# Altium schematic sheet JTAG&CONFIG.SchDoc: JTAG Chain +
size 420 x 297 mm; CheckedBy: T.Janicki; CompanyName: Creotech Instruments SA; DrawnBy: Greg Kasprowicz; Organization: CERN; Address1: European Organization for Nuclear Research; Address2: CH-1211 Geneve 23 - Switzerland; DocumentNumber: 10; Revision: -; SheetNumber: 10; SheetTotal: 17; EDA_Number: EDA-xxxx; Projet: Simple VME FMC Carrier; CreateDate: 20/11/2012; CheckedDate: 23/01/2012; Title2: FPGA Flash; DivGrp: BE-CO; Designer: G.Kasprowicz; DocumentName: jtag_chain.SchDoc; ModifiedDate: -; Rule: PcbType=ProtelPcb
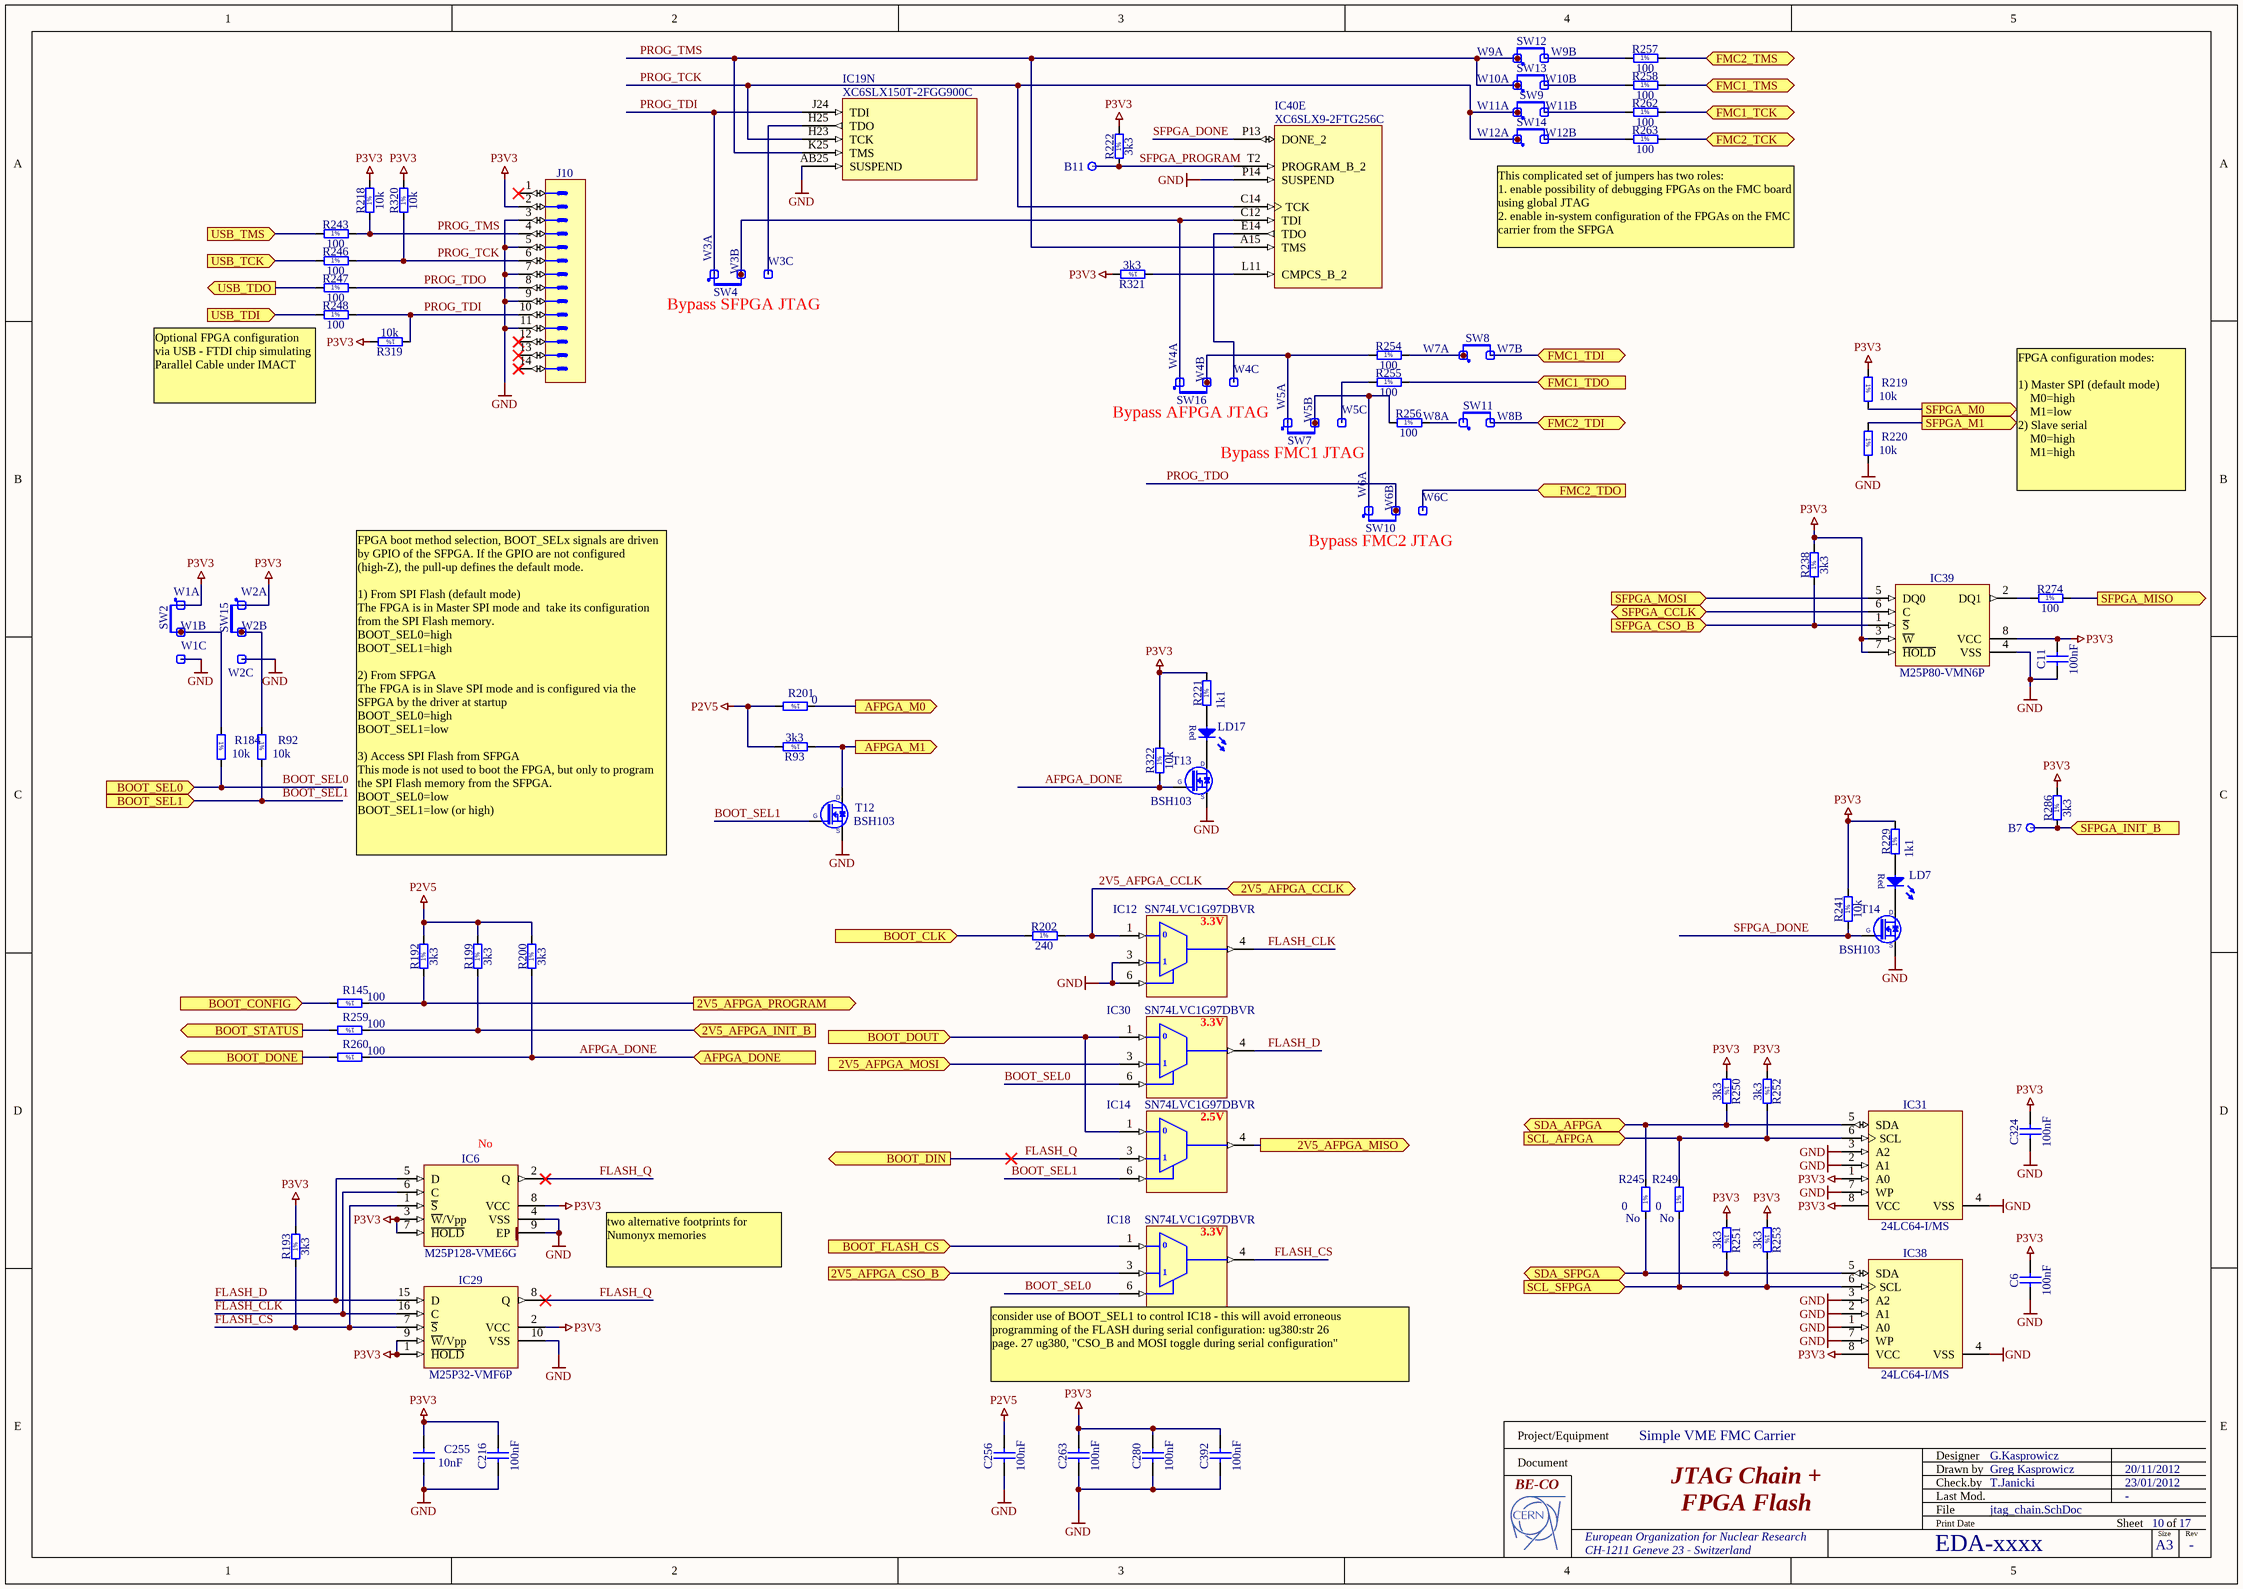
[diagram p0: JTAG&CONFIG.SchDoc]

## Parts
B7  Plated Hole  [c130h80]  (value not drawn)
B11  Plated Hole  [c130h80]  (value not drawn)
C6  100nF  [CAPC1005X55N]
C11  100nF  [CAPC1005X55N]
C216  100nF  [CAPC1005X55N]
C255  10nF  [CAPC1608X87N]
C256  100nF  [CAPC1005X55N]
C263  100nF  [CAPC1005X55N]
C280  100nF  [CAPC1005X55N]
C324  100nF  [CAPC1005X55N]
C392  100nF  [CAPC1005X55N]
IC6  M25P128-VME6G  Mounted: No  [PSON127P800X600X100-9N-R640X480]
IC12  SN74LVC1G97DBVR  [SOT95P280X145-6N]
IC14  SN74LVC1G97DBVR  [SOT95P280X145-6N]
IC18  SN74LVC1G97DBVR  [SOT95P280X145-6N]
IC19  XC6SLX150T-2FGG900C  [BGA900C100P30X30_3100X3100X260]  (part N of 18)
IC29  M25P32-VMF6P  [SOIC127P1030X265-16N]
IC30  SN74LVC1G97DBVR  [SOT95P280X145-6N]
IC31  24LC64-I/MS  [SOP65P490X110-8N]
IC38  24LC64-I/MS  [SOP65P490X110-8N]
IC39  M25P80-VMN6P  [SOIC127P600X175-8N]
IC40  XC6SLX9-2FTG256C  [BGA256C100P16X16_1700X1700X155]  (part E of 7)
J10  Milli-Grid  [MOLEX_87832-1420]  (value not drawn)
LD7  Red  [LEDC1608X80N_RED]  (value not drawn)
LD17  Red  [LEDC1608X80N_RED]  (value not drawn)
R92  10k  [RESC1608X55N]
R93  3k3  [RESC1608X55N]
R145  100  [RESC1608X55N]
R184  10k  [RESC1608X55N]
R192  3k3  [RESC1608X55N]
R193  3k3  [RESC1608X55N]
R199  3k3  [RESC1608X55N]
R200  3k3  [RESC1608X55N]
R201  0  [RESC1608X55N]
R202  240  [RESC1608X55N]
R218  10k  [RESC1608X55N]
R219  10k  [RESC1608X55N]
R220  10k  [RESC1608X55N]
R221  1k1  [RESC1608X55N]
R222  3k3  [RESC1608X55N]
R229  1k1  [RESC1608X55N]
R238  3k3  [RESC1608X55N]
R241  10k  [RESC1608X55N]
R243  100  [RESC1608X55N]
R245  0  Mounted: No  [RESC1608X55N]
R246  100  [RESC1608X55N]
R247  100  [RESC1608X55N]
R248  100  [RESC1608X55N]
R249  0  Mounted: No  [RESC1608X55N]
R250  3k3  [RESC1608X55N]
R251  3k3  [RESC1608X55N]
R252  3k3  [RESC1608X55N]
R253  3k3  [RESC1608X55N]
R254  100  [RESC1608X55N]
R255  100  [RESC1608X55N]
R256  100  [RESC1608X55N]
R257  100  [RESC1608X55N]
R258  100  [RESC1608X55N]
R259  100  [RESC1608X55N]
R260  100  [RESC1608X55N]
R262  100  [RESC1608X55N]
R263  100  [RESC1608X55N]
R274  100  [RESC1608X55N]
R286  3k3  [RESC1608X55N]
R319  10k  [RESC1608X55N]
R320  10k  [RESC1608X55N]
R321  3k3  [RESC1608X55N]
R322  10k  [RESC1608X55N]
SW2  Jumper Type1  [JUMPER_BLACK_INSULATED_2.54MM]  (value not drawn)
SW4  Jumper Type1  [JUMPER_BLACK_INSULATED_2.54MM]  (value not drawn)
SW7  Jumper Type1  [JUMPER_BLACK_INSULATED_2.54MM]  (value not drawn)
SW8  Jumper Type1  [JUMPER_BLACK_INSULATED_2.54MM]  (value not drawn)
SW9  Jumper Type1  [JUMPER_BLACK_INSULATED_2.54MM]  (value not drawn)
SW10  Jumper Type1  [JUMPER_BLACK_INSULATED_2.54MM]  (value not drawn)
SW11  Jumper Type1  [JUMPER_BLACK_INSULATED_2.54MM]  (value not drawn)
SW12  Jumper Type1  [JUMPER_BLACK_INSULATED_2.54MM]  (value not drawn)
SW13  Jumper Type1  [JUMPER_BLACK_INSULATED_2.54MM]  (value not drawn)
SW14  Jumper Type1  [JUMPER_BLACK_INSULATED_2.54MM]  (value not drawn)
SW15  Jumper Type1  [JUMPER_BLACK_INSULATED_2.54MM]  (value not drawn)
SW16  Jumper Type1  [JUMPER_BLACK_INSULATED_2.54MM]  (value not drawn)
T12  BSH103  [SOT95P230X110-3N]
T13  BSH103  [SOT95P230X110-3N]
T14  BSH103  [SOT95P230X110-3N]
W1  Test Point  [COMATEL_385.0358.1.03.400]  (value not drawn)  (parts A,B,C of 3)
W2  Test Point  [COMATEL_385.0358.1.03.400]  (value not drawn)  (parts A,B,C of 3)
W3  Test Point  [COMATEL_385.0358.1.03.400]  (value not drawn)  (parts A,B,C of 3)
W4  Test Point  [COMATEL_385.0358.1.03.400]  (value not drawn)  (parts A,B,C of 3)
W5  Test Point  [COMATEL_385.0358.1.03.400]  (value not drawn)  (parts A,B,C of 3)
W6  Test Point  [COMATEL_385.0358.1.03.400]  (value not drawn)  (parts A,B,C of 3)
W7  Test Point  [COMATEL_385.0358.1.02.400]  (value not drawn)  (parts A,B of 2)
W8  Test Point  [COMATEL_385.0358.1.02.400]  (value not drawn)  (parts A,B of 2)
W9  Test Point  [COMATEL_385.0358.1.02.400]  (value not drawn)  (parts A,B of 2)
W10  Test Point  [COMATEL_385.0358.1.02.400]  (value not drawn)  (parts A,B of 2)
W11  Test Point  [COMATEL_385.0358.1.02.400]  (value not drawn)  (parts A,B of 2)
W12  Test Point  [COMATEL_385.0358.1.02.400]  (value not drawn)  (parts A,B of 2)

## Ports
2V5_AFPGA_CCLK (bidir), 2V5_AFPGA_CSO_B (in), 2V5_AFPGA_INIT_B (in), 2V5_AFPGA_MISO (out), 2V5_AFPGA_MOSI (in), 2V5_AFPGA_PROGRAM (out), AFPGA_DONE (in), AFPGA_M0 (out), AFPGA_M1 (out), BOOT_CLK (in), BOOT_CONFIG (in), BOOT_DIN (out), BOOT_DONE (out), BOOT_DOUT (in), BOOT_FLASH_CS (in), BOOT_SEL0 (in), BOOT_SEL1 (in), BOOT_STATUS (out), FMC1_TCK (bidir), FMC1_TDI (bidir), FMC1_TDO (in), FMC1_TMS (bidir), FMC2_TCK (bidir), FMC2_TDI (bidir), FMC2_TDO (in), FMC2_TMS (bidir), SCL_AFPGA (in), SCL_SFPGA (in), SDA_AFPGA (bidir), SDA_SFPGA (bidir), SFPGA_CCLK (bidir), SFPGA_CSO_B (in), SFPGA_INIT_B (in), SFPGA_M0 (out), SFPGA_M1 (out), SFPGA_MISO (out), SFPGA_MOSI (in), USB_TCK (in), USB_TDI (in), USB_TDO (out), USB_TMS (in)

## Nets
GND: C6.2 C11.2 C216.1 C255.1 C256.1 C263.1 C280.1 C324.2 C392.1 IC6.4(VSS) IC6.9(EP) IC12.2(GND) IC12.3(IN0) IC12.6(IN2) IC14.2(GND) IC18.2(GND) IC19.AB25(SUSPEND) IC29.10(VSS) IC30.2(GND) IC31.2(A1) IC31.3(A2) IC31.4(VSS) IC31.7(WP) IC38.1(A0) IC38.2(A1) IC38.3(A2) IC38.4(VSS) IC38.7(WP) IC39.4(VSS) IC40.P14(SUSPEND) J10.3 J10.5 J10.7 J10.9 J10.11 R220.2 T12.2(S) T13.2(S) T14.2(S) W1.3 W2.3
P2V5: C256.2 IC14.5(VCC) R93.2 R192.2 R199.2 R200.2 R201.2
P3V3: C6.1 C11.1 C216.2 C255.2 C263.2 C280.2 C324.1 C392.2 IC6.3(~{W}/Vpp) IC6.7(~{HOLD}) IC6.8(VCC) IC12.5(VCC) IC18.5(VCC) IC29.1(~{HOLD}) IC29.2(VCC) IC29.9(~{W}/Vpp) IC30.5(VCC) IC31.1(A0) IC31.8(VCC) IC38.8(VCC) IC39.3(~{W}) IC39.7(~{HOLD}) IC39.8(VCC) J10.2 R193.2 R218.2 R219.1 R221.2 R222.2 R229.2 R238.2 R241.2 R250.1 R251.1 R252.1 R253.1 R286.2 R319.2 R320.2 R321.2 R322.2 W1.1 W2.1
2V5_AFPGA_CCLK: IC12.1(IN1) R202.2 ; port 2V5_AFPGA_CCLK
2V5_AFPGA_CSO_B: IC18.3(IN0) ; port 2V5_AFPGA_CSO_B
2V5_AFPGA_INIT_B: R199.1 R259.1 ; port 2V5_AFPGA_INIT_B
2V5_AFPGA_MISO: IC14.4(Y) ; port 2V5_AFPGA_MISO
2V5_AFPGA_MOSI: IC30.3(IN0) ; port 2V5_AFPGA_MOSI
2V5_AFPGA_PROGRAM: R145.1 R192.1 ; port 2V5_AFPGA_PROGRAM
AFPGA_DONE: R200.1 R260.1 R322.1 T13.1(G) ; port AFPGA_DONE
AFPGA_M0: R201.1 ; port AFPGA_M0
AFPGA_M1: R93.1 T12.3(D) ; port AFPGA_M1
BOOT_CLK: R202.1 ; port BOOT_CLK
BOOT_CONFIG: R145.2 ; port BOOT_CONFIG
BOOT_DONE: R260.2 ; port BOOT_DONE
BOOT_DOUT: IC14.1(IN1) IC30.1(IN1) ; port BOOT_DOUT
BOOT_FLASH_CS: IC18.1(IN1) ; port BOOT_FLASH_CS
BOOT_SEL0: IC18.6(IN2) IC30.6(IN2) R184.2 ; port BOOT_SEL0
BOOT_SEL1: IC14.6(IN2) R92.2 T12.1(G) ; port BOOT_SEL1
BOOT_STATUS: R259.2 ; port BOOT_STATUS
FLASH_CLK: IC6.6(C) IC12.4(Y) IC29.16(C)
FLASH_CS: IC6.1(~{S}) IC18.4(Y) IC29.7(~{S}) R193.1
FLASH_D: IC6.5(D) IC29.15(D) IC30.4(Y)
FLASH_Q: IC6.2(Q) IC14.3(IN0) IC29.8(Q) ; port BOOT_DIN
FMC1_TCK: R262.2 ; port FMC1_TCK
FMC1_TDI: W7.2 ; port FMC1_TDI
FMC1_TDO: R255.2 ; port FMC1_TDO
FMC1_TMS: R258.2 ; port FMC1_TMS
FMC2_TCK: R263.2 ; port FMC2_TCK
FMC2_TDI: W8.2 ; port FMC2_TDI
FMC2_TDO: W6.3 ; port FMC2_TDO
FMC2_TMS: R257.2 ; port FMC2_TMS
PROG_TCK: IC19.H23(TCK) IC40.C14(TCK) J10.6 R246.2 R320.1 SW9.1 SW14.1 W11.1 W12.1
PROG_TDI: IC19.J24(TDI) J10.10 R248.2 R319.1 W3.1
PROG_TDO: J10.8 R247.2 SW10.1 W6.2
PROG_TMS: IC19.K25(TMS) IC40.A15(TMS) J10.4 R218.1 R243.2 SW12.1 SW13.1 W9.1 W10.1
SCL_AFPGA: IC31.6(SCL) R249.2 R252.2 ; port SCL_AFPGA
SCL_SFPGA: IC38.6(SCL) R249.1 R253.2 ; port SCL_SFPGA
SDA_AFPGA: IC31.5(SDA) R245.2 R250.2 ; port SDA_AFPGA
SDA_SFPGA: IC38.5(SDA) R245.1 R251.2 ; port SDA_SFPGA
SFPGA_CCLK: IC39.6(C) ; port SFPGA_CCLK
SFPGA_CSO_B: IC39.1(~{S}) R238.1 ; port SFPGA_CSO_B
SFPGA_DONE: IC40.P13(DONE_2) R241.1 T14.1(G)
SFPGA_INIT_B: B7.1 R286.1 ; port SFPGA_INIT_B
SFPGA_M0: R219.2 ; port SFPGA_M0
SFPGA_M1: R220.1 ; port SFPGA_M1
SFPGA_MISO: R274.2 ; port SFPGA_MISO
SFPGA_MOSI: IC39.5(DQ0) ; port SFPGA_MOSI
SFPGA_PROGRAM: B11.1 IC40.T2(PROGRAM_B_2) R222.1
USB_TCK: R246.1 ; port USB_TCK
USB_TDI: R248.1 ; port USB_TDI
USB_TDO: R247.1 ; port USB_TDO
USB_TMS: R243.1 ; port USB_TMS
NetIC19_H25: IC19.H25(TDO) W3.3
NetIC39_2: IC39.2(DQ1) R274.1
NetIC40_C12: IC40.C12(TDI) SW4.1 W3.2 W4.1
NetIC40_E14: IC40.E14(TDO) W4.3
NetIC40_L11: IC40.L11(CMPCS_B_2) R321.1
NetLD7_1: LD7.1(C) T14.3(D)
NetLD7_2: LD7.2(A) R229.1
NetLD17_1: LD17.1(C) T13.3(D)
NetLD17_2: LD17.2(A) R221.1
NetR92_1: R92.1 SW15.1 W2.2
NetR184_1: R184.1 SW2.1 W1.2
NetR254_1: R254.1 SW16.1 W4.2 W5.1
NetR254_2: R254.2 SW8.1 W7.1
NetR255_1: R255.1 W5.3
NetR256_1: R256.1 SW7.1 W5.2 W6.1
NetR257_1: R257.1 W9.2
NetR258_1: R258.1 W10.2
NetR262_1: R262.1 W11.2
NetR263_1: R263.1 W12.2
NetSW11_1: SW11.1 W8.1

Not connected (* = marked no-connect by the designer): J10 1* 12* 13* 14*; R256 2

## Notes on the sheet
- This complicated set of jumpers has two roles:
  1. enable possibility of debugging FPGAs on the FMC board using global JTAG
  2. enable in-system configuration of the FPGAs on the FMC carrier from the SFPGA
- Bypass SFPGA JTAG
- (near R248) Optional FPGA configuration via USB - FTDI chip simulating Parallel Cable under IMACT
- Bypass AFPGA JTAG
- Bypass FMC1 JTAG
- FPGA configuration modes:
  1) Master SPI (default mode)
  M0=high
  M1=low
  2) Slave serial
  M0=high
  M1=high
- Bypass FMC2 JTAG
- FPGA boot method selection, BOOT_SELx signals are driven by GPIO of the SFPGA. If the GPIO are not configured (high-Z), the pull-up defines the default mode.
  1) From SPI Flash (default mode)
  The FPGA is in Master SPI mode and  take its configuration from the SPI Flash memory.
  BOOT_SEL0=high
  BOOT_SEL1=high
  2) From SFPGA
  The FPGA is in Slave SPI mode and is configured via the SFPGA by the driver at startup
  BOOT_SEL0=high
  BOOT_SEL1=low
  3) Access SPI Flash from SFPGA
  This mode is not used to boot the FPGA, but only to program the SPI Flash memory from the SFPGA.
  BOOT_SEL0=low
  BOOT_SEL1=low (or high)
- (near IC12) 0
- (near IC12) 3.3V
- (near IC12) 1
- (near IC30) 3.3V
- (near IC30) 0
- (near IC30) 1
- (near IC14) 0
- (near IC14) 2.5V
- (near IC14) 1
- two alternative footprints for Numonyx memories
- (near IC18) 0
- (near IC18) 1
- (near IC18) 3.3V
- (near IC18) consider use of BOOT_SEL1 to control IC18 - this will avoid erroneous programming of the FLASH during serial configuration: ug380:str 26
  page. 27 ug380, "CSO_B and MOSI toggle during serial configuration"
- Project/Equipment
- Document
- Designer
- Drawn by
- Check.by
- File
- Last Mod.
- Print Date
- Sheet
- Size
- A3
- of
- Rev
- (in symbol R0603_0R_JUMPER) 1%
- (in symbol R0603_1K1_1%_0.1W_100PPM) 1%
- (in symbol R0603_3K3_1%_0.1W_100PPM) 1%
- (in symbol R0603_10K_1%_0.1W_100PPM) 1%
- (in symbol R0603_100R_1%_0.1W_100PPM) 1%
- (in symbol R0603_240R_1%_0.1W_100PPM) 1%

## Library data of the parts
B7 B11 = PLATED_HOLE0.8_PAD1.3: Single Terminal Socket; Part Description: Plated Through Hole: Hole Dia.=0.8mm Pad Dia.=1.3mm; Mounted: No; Table: Pads; Part Number: PLATED_HOLE0.8_PAD1.3; Component Kind: Standard (No BOM); Component Type: Standard (No BOM); Pin Count: 1; Family: Plated Hole; Socket: No; SMD: No; Status: None; ComponentHeight: 0mm; Author: CERN DEM JLC; CreateDate: 2008-10-30; LatestRevisionDate: 2008-10-30; PackageDescription: Plated Through Hole: Hole Dia.=0.8mm Pad Dia.=1.3mm
C6 C11 C216 C256 C263 C280 C324 C392 = CC0402_100NF_16V_10%_X7R: Non-polarised capacitor; Part Description: SMD Multilayer Chip Ceramic Capacitor; Manufacturer: GENERIC; Manufacturer1 Part Number: 223878715649; Voltage: 16V; TC: X7R; Tolerance: ±10%; Table: Capacitors SMD; Part Number: CC0402_100NF_16V_10%_X7R; Component Kind: Standard; Component Type: Standard; Pin Count: 2; Value: 100nF; Status: Not Recommended; Manufacturer Part Number: CC0402_100NF_16V_10%_X7R; Case: 0402; Mounted: Yes; Socket: No; SMD: Yes; Manufacturer1 Example: PHYCOMP; Manufacturer1 ComponentHeight: 0.55mm; HelpURL: \\cern.ch\dfs\Applications\Altium\Datasheets\CC0402_X7R_PHYCOMP.pdf; Author: CERN DEM JLC
  C6 C11 C324: CreateDate: 12/3/2007; LatestRevisionDate: 12/3/2007
  C216 C256 C263 C280 C392: CreateDate: 2007-12-03; LatestRevisionDate: 2007-12-03
C255 = CC0603_10NF_50V_10%_X7R: Non-polarised capacitor; Part Description: SMD Multilayer Chip Ceramic Capacitor; Manufacturer: GENERIC; Manufacturer1 Part Number: 223858615636; Voltage: 50V; TC: X7R; Tolerance: ±10%; Table: Capacitors SMD; Part Number: CC0603_10NF_50V_10%_X7R; Component Kind: Standard; Component Type: Standard; Pin Count: 2; Value: 10nF; Status: Preferred; Manufacturer Part Number: CC0603_10NF_50V_10%_X7R; Case: 0603; Mounted: Yes; Socket: No; SMD: Yes; Manufacturer1 Example: PHYCOMP; Manufacturer1 ComponentHeight: 0.87mm; HelpURL: \\cern.ch\dfs\Applications\Altium\Datasheets\CC0603_X7R_PHYCOMP.pdf; Author: CERN DEM JLC; CreateDate: 03/12/2007; LatestRevisionDate: 03/12/2007
IC6 = M25P128-VME6G: 128 Mbit (Multilevel), low-voltage, Serial Flash memory with 50-MHz SPI bus interface; Manufacturer: NUMONYX; Table: Logic; Part Number: M25P128-VME6G; Component Kind: Standard; Component Type: Standard; Device: M25P128-VME6G; PackageDescription: SON,1.27mm,pitch; 8 pin,8.00mm W X 6.00mm L X 1.00mm H body (w/pullback leads,thermal tab 6.4 X 4.8mm), IPC Medium Density; Part Description: 128 Mbit (Multilevel), Low-Voltage, Serial Flash Memory With 50-MHz SPI Bus Interface; Manufacturer Part Number: M25P128-VME6G; Pin Count: 9; Case: SON8; Socket: No; SMD: Yes; ComponentHeight: 1mm; HelpURL: \\cern.ch\dfs\Applications\Altium\Datasheets\M25P128-VME6G.pdf; Author: CERN DEM JLC; CreateDate: 2010-01-20; LatestRevisionDate: 2010-01-20
IC12 IC14 IC18 IC30 = SN74LVC1G97DBVR: Configurable Multiple-Function Gate; Manufacturer: TEXAS INSTRUMENTS; Table: Standard Logic; Part Number: SN74LVC1G97DBVR; Component Kind: Standard; Component Type: Standard; Device: SN74LVC1G97DBVR; PackageDescription: SOT23, 6-Leads, Body 3.0x3.0mm (max), Pitch 0.95mm, IPC Medium Density; Part Description: Configurable Multiple-Function Gate; Manufacturer Part Number: SN74LVC1G97DBVR; Pin Count: 6; Case: SOT23-6; Mounted: Yes; Socket: No; SMD: Yes; ComponentHeight: 1.45mm; Author: CERN DEM JLC; HelpURL: \\cern.ch\dfs\Applications\Altium\Datasheets\SN74LVC1G97DBVR.pdf; CreateDate: 2/15/2011; LatestRevisionDate: 2/15/2011
IC19 = XC6SLX150T-2FGG900C: SPARTAN-6, FPGA, 900-Ball BGA, Commercial Grade, Pb-Free; Part Description: SPARTAN-6, FPGA, 540 User I/Os, 8 GTPs, 900-Ball BGA, Commercial Grade, Pb-Free; Manufacturer: XILINX; Table: Logic; Part Number: XC6SLX150T-2FGG900C; Component Kind: Standard; Component Type: Standard; Device: XC6SLX150T-2FGG900C; PackageDescription: BGA,1.00mm pitch, square; 900 pin, 30 columns X 30 rows, 31.00mm X 31.00mm X 2.60mm H, IPC Medium Density; Manufacturer Part Number: XC6SLX150T-2FGG900C; Pin Count: 900; Case: BGA900; Mounted: Yes; Socket: No; SMD: Yes; ComponentHeight: 2.6mm; HelpURL: \\cern.ch\dfs\Applications\Altium\Datasheets\XC6SLX150T-2FGG900C.pdf; ComponentLink1URL: \\cern.ch\dfs\Applications\Altium\Datasheets\XC6SLX150T-2FGG900C_Package-Pinouts.pdf; ComponentLink1Description: Package/Pinouts; Author: CERN DEM JLC; CreateDate: 2009-11-17; LatestRevisionDate: 2009-11-17
IC29 = M25P32-VMF6P: 32 Mbit, low-voltage, Serial Flash memory with 75-MHz SPI bus interface; Part Description: 32 Mbit, Low-Voltage, Serial Flash Memory With 75MHz SPI Bus Interface; Manufacturer: MICRON; Table: Logic; Part Number: M25P32-VMF6P; Component Kind: Standard; Component Type: Standard; Device: M25P32-VMF6P; PackageDescription: SOIC 16, Pitch 1.27mm - Body 7.5x10.3mm, IPC Medium Density; Manufacturer Part Number: M25P32-VMF6P; Pin Count: 8; Case: SOIC16; Mounted: Yes; Socket: No; SMD: Yes; ComponentHeight: 2.65mm; HelpURL: \\cern.ch\dfs\Applications\Altium\Datasheets\M25P32-VMF6P.pdf; Author: CERN DEM JLC; CreateDate: 2010-10-21; LatestRevisionDate: 2011-07-18
IC31 IC38 = 24LC64-I/MS: 64K I2C Serial EEPROM; Part Description: 2.5V-5.5V, 64K (8K x 8-bit) I2C Serial EEPROM; Manufacturer: MICROCHIP TECHNOLOGY; Table: Logic; Part Number: 24LC64-I/MS; Component Kind: Standard; Component Type: Standard; Device: 24LC64-I/MS; PackageDescription: SOP, 0.65mm pitch; 8 pin, 3.00mm W X 3.00mm L X 1.10mm H body, IPC Medium Density; Manufacturer Part Number: 24LC64-I/MS; Pin Count: 8; Case: MSOP8; Mounted: Yes; Socket: No; SMD: Yes; ComponentHeight: 1.1mm; HelpURL: \\cern.ch\dfs\Applications\Altium\Datasheets\24LC64-I-MS.pdf; Author: CERN DEM JLC; CreateDate: 2011-01-24; LatestRevisionDate: 2011-01-24
IC39 = M25P80-VMN6P: 8 Mbit, 2.7V to 3.6V Serial Flash Embedded Memory; Manufacturer: NUMONYX; Table: Logic; Part Number: M25P80-VMN6P; Component Kind: Standard; Component Type: Standard; Device: M25P80-VMN6P; PackageDescription: SOIC 8, Pitch 1.27mm - Body 4x5mm, IPC Medium Density; Part Description: 8 Mbit, 2.7V to 3.6V Serial Flash Embedded Memory; Manufacturer Part Number: M25P80-VMN6P; Pin Count: 8; Case: SOIC8; Mounted: Yes; Socket: No; SMD: Yes; ComponentHeight: 1.75mm; HelpURL: \\cern.ch\dfs\Applications\Altium\Datasheets\M25P80-VMN6P.pdf; Author: CERN DEM JLC; CreateDate: 2011-10-05; LatestRevisionDate: 2011-10-05
IC40 = XC6SLX9-2FTG256C: Spartan-6 LX 1.2V FPGA, 186 User I/Os, 256-Ball Fine-Pitch Thin BGA (1.0mm Pitch), Speed Grade 2, Commercial Grade, Pb-Free; Manufacturer: XILINX; Table: Logic; Part Number: XC6SLX9-2FTG256C; Component Kind: Standard; Component Type: Standard; Device: XC6SLX9-2FTG256C; PackageDescription: BGA 1mm, Pitch, Square 256 Pin, 16 Columns x 16 Rows, Body 17mm X 17mm X 1.55mm H; Part Description: Spartan-6 LX 1.2V FPGA, 186 User I/Os, 256-Ball Fine-Pitch Thin BGA (1.0mm Pitch), Speed Grade 2, Commercial Grade, Pb-Free; Manufacturer Part Number: XC6SLX9-2FTG256C; Pin Count: 256; Case: BGA256; Mounted: Yes; Socket: No; SMD: Yes; ComponentHeight: 1.55mm; HelpURL: \\cern.ch\dfs\Applications\Altium\Datasheets\XC6SLX9-2FTG256C.pdf; ComponentLink1URL: \\cern.ch\dfs\Applications\Altium\Datasheets\XC6SLX9-2FTG256C_Package-Pinout.pdf; ComponentLink1Description: Package/Pinouts; Author: CERN DEM JLC; CreateDate: 2011-11-01; LatestRevisionDate: 2011-11-01
J10 = MOLEX_87832-1420: Connector 14 Male; Part Description: 2.00mm (.079") Pitch Milli-Grid™ Header, Surface Mount, Vertical, Shrouded, 14 Circuits,with Locking Windows and Centre Polarization Slot, PCB Locator; Manufacturer: MOLEX; Part Number: MOLEX_87832-1420; Component Kind: Standard; Component Type: Standard; Pin Count: 14; Family: Milli-Grid; Mounted: Yes; Socket: No; SMD: Yes; Manufacturer Part Number: 87832-1420; ComponentHeight: 6.4mm; HelpURL: \\cern.ch\dfs\Applications\Altium\Datasheets\MOLEX_87832-1420.pdf; Author: CERN DEM JLC; CreateDate: 9/9/2008; LatestRevisionDate: 9/9/2008; Table: MOLEX
LD7 LD17 = LED_ROHM_SML-311UTT86K: LED Red 1C 2A; Part Description: Low current chip LED SML-311 Serie; Manufacturer: ROHM; Table: LEDs & Displays; Part Number: LED_ROHM_SML-311UTT86K; Component Kind: Standard; Component Type: Standard; Color: Red; PackageDescription: Chip RED LED, 2-Leads, Body 1.6x0.8mm, IPC Medium Density; Manufacturer Part Number: SML-311UTT86K; Pin Count: 2; Mounted: Yes; Socket: No; SMD: Yes; ComponentHeight: 0.8mm; HelpURL: \\cern.ch\dfs\Applications\Altium\Datasheets\LED_ROHM_SML-311UTT86K.pdf; Author: CERN DEM JLC; CreateDate: 3/16/2010; LatestRevisionDate: 3/17/2010
R92 R184 R218-R220 R241 R319 R320 R322 = R0603_10K_1%_0.1W_100PPM: Resistor - 1%; Part Description: General Purpose Thick Film Chip Resistor; Manufacturer: GENERIC; Manufacturer1 Part Number: NRC06F1002TRF; Power: 0.1W; TC: ±100ppm/°C; Table: Resistors SMD; Part Number: R0603_10K_1%_0.1W_100PPM; Component Kind: Standard; Component Type: Standard; Pin Count: 2; Value: 10k; Status: Preferred; Tolerance: ±1%; Manufacturer Part Number: R0603_10K_1%_0.1W_100PPM; Case: 0603; Mounted: Yes; Socket: No; SMD: Yes; Manufacturer1 Example: NIC COMPONENT; Manufacturer1 ComponentHeight: 0.55mm; HelpURL: \\cern.ch\dfs\Applications\Altium\Datasheets\R0603_NIC_NRC.pdf; Author: CERN DEM JLC
  R92 R184 R219 R220: CreateDate: 12/3/2007; LatestRevisionDate: 3/13/2008
  R218 R241 R319 R320 R322: CreateDate: 2007-12-03; LatestRevisionDate: 2008-03-13
R93 R192 R193 R199 R200 R222 R238 R250-R253 R286 R321 = R0603_3K3_1%_0.1W_100PPM: Resistor - 1%; Part Description: General Purpose Thick Film Chip Resistor; Manufacturer: GENERIC; Manufacturer1 Part Number: NRC06F3301TRF; Power: 0.1W; TC: ±100ppm/°C; Table: Resistors SMD; Part Number: R0603_3K3_1%_0.1W_100PPM; Component Kind: Standard; Component Type: Standard; Pin Count: 2; Value: 3k3; Status: Preferred; Tolerance: ±1%; Manufacturer Part Number: R0603_3K3_1%_0.1W_100PPM; Case: 0603; Mounted: Yes; Socket: No; SMD: Yes; Manufacturer1 Example: NIC COMPONENT; Manufacturer1 ComponentHeight: 0.55mm; HelpURL: \\cern.ch\dfs\Applications\Altium\Datasheets\R0603_NIC_NRC.pdf; Author: CERN DEM JLC; CreateDate: 12/3/2007; LatestRevisionDate: 3/13/2008
R145 R243 R246-R248 R254-R260 R262 R263 R274 = R0603_100R_1%_0.1W_100PPM: Resistor - 1%; Part Description: General Purpose Thick Film Chip Resistor; Manufacturer: GENERIC; Manufacturer1 Part Number: NRC06F4700TRF; Power: 0.1W; TC: ±100ppm/°C; Table: Resistors SMD; Part Number: R0603_100R_1%_0.1W_100PPM; Component Kind: Standard; Component Type: Standard; Pin Count: 2; Value: 100; Status: Preferred; Tolerance: ±1%; Manufacturer Part Number: R0603_100R_1%_0.1W_100PPM; Case: 0603; Mounted: Yes; Socket: No; SMD: Yes; Manufacturer1 Example: NIC COMPONENT; Manufacturer1 ComponentHeight: 0.55mm; HelpURL: \\cern.ch\dfs\Applications\Altium\Datasheets\R0603_NIC_NRC.pdf; Author: CERN DEM JLC; CreateDate: 2007-12-03; LatestRevisionDate: 2008-03-13
R201 R245 R249 = R0603_0R_JUMPER: Resistor - 1%; Part Description: 1A (0.05R Max DC Resistance) Zero Ohm Jumper; Manufacturer: GENERIC; Manufacturer1 Part Number: NRC06Z0; Table: Resistors SMD; Part Number: R0603_0R_JUMPER; Component Kind: Standard; Component Type: Standard; Pin Count: 2; Value: 0; Status: Preferred; Manufacturer Part Number: R0603_0R_JUMPER; Case: 0603; Socket: No; SMD: Yes; Manufacturer1 Example: NIC COMPONENT; Manufacturer1 ComponentHeight: 0.55mm; HelpURL: \\cern.ch\dfs\Applications\Altium\Datasheets\R0603_NIC_NRC.pdf; Author: CERN DEM JLC
  R201: Mounted: Yes; CreateDate: 12/3/2007; LatestRevisionDate: 3/13/2008
  R245 R249: CreateDate: 2007-12-03; LatestRevisionDate: 2008-03-13
R202 = R0603_240R_1%_0.1W_100PPM: Resistor - 1%; Part Description: General Purpose Thick Film Chip Resistor; Manufacturer: GENERIC; Manufacturer1 Part Number: NRC06F2400TRF; Power: 0.1W; TC: ±100ppm/°C; Table: Resistors SMD; Part Number: R0603_240R_1%_0.1W_100PPM; Component Kind: Standard; Component Type: Standard; Pin Count: 2; Value: 240; Status: Preferred; Tolerance: ±1%; Manufacturer Part Number: R0603_240R_1%_0.1W_100PPM; Case: 0603; Mounted: Yes; Socket: No; SMD: Yes; Manufacturer1 Example: NIC COMPONENT; Manufacturer1 ComponentHeight: 0.55mm; HelpURL: \\cern.ch\dfs\Applications\Altium\Datasheets\R0603_NIC_NRC.pdf; Author: CERN DEM JLC; CreateDate: 12/3/2007; LatestRevisionDate: 3/13/2008
R221 R229 = R0603_1K1_1%_0.1W_100PPM: Resistor - 1%; Part Description: General Purpose Thick Film Chip Resistor; Manufacturer: GENERIC; Manufacturer1 Part Number: NRC06F1101TRF; Power: 0.1W; TC: ±100ppm/°C; Table: Resistors SMD; Part Number: R0603_1K1_1%_0.1W_100PPM; Component Kind: Standard; Component Type: Standard; Pin Count: 2; Value: 1k1; Status: Preferred; Tolerance: ±1%; Manufacturer Part Number: R0603_1K1_1%_0.1W_100PPM; Case: 0603; Mounted: Yes; Socket: No; SMD: Yes; Manufacturer1 Example: NIC COMPONENT; Manufacturer1 ComponentHeight: 0.55mm; HelpURL: \\cern.ch\dfs\Applications\Altium\Datasheets\R0603_NIC_NRC.pdf; Author: CERN DEM JLC; CreateDate: 2007-12-03; LatestRevisionDate: 2008-03-13
SW2 SW4 SW7-SW16 = COMATEL_313.1730.0.00.40.0: Jumper 1 Pin; Part Description: Closed Insulated Black Jumper Pitch 2.54mm; Manufacturer: KONTEK COMATEL; SCEM: 09.55.10.960.9; Part Number: COMATEL_313.1730.0.00.40.0; Component Kind: Standard; Component Type: Standard; Pin Count: 1; Family: Jumper; Mounted: Yes; Socket: No; SMD: No; Status: None; Manufacturer Part Number: 313.1730.0.00.40.0; ComponentHeight: 6.5mm; HelpURL: \\cern.ch\dfs\Applications\Altium\Datasheets\COMATEL_313.1730.0.00.40.0.pdf; Author: CERN DEM JLC; CreateDate: 09/04/2008; LatestRevisionDate: 30/06/2010; Table: COMATEL
T12-T14 = BSH103: N-CHANNEL MOSFET WITH DIODE; Part Description: 50V 200mA N-Channel Enhancement Mode Field-Effect Transistor; Manufacturer: NXP SEMICONDUCTORS; Table: Transistors; Part Number: BSH103; Component Kind: Standard; Component Type: Standard; Device: BSH103; PackageDescription: SOT23, 3 pin, Pitch 0.95mm - 1.3mm W X 2.9mm L X 1.1mm H, IPC Medium Density; Manufacturer Part Number: BSH103; Pin Count: 3; Case: SOT23-3; Mounted: Yes; Socket: No; SMD: Yes; ComponentHeight: 1.1mm; HelpURL: \\cern.ch\dfs\Applications\Altium\Datasheets\BSH103.pdf; Author: CERN DEM JLC; CreateDate: 3/16/2010; LatestRevisionDate: 3/16/2010
W1-W6 = COMATEL_385.0358.1.03.400: 3 Mini Wire-Wrap Contact Strip Header; Part Description: 3 Contacts Straight Strip Header Pitch 2.54mm L=6.3mm ''Mini-Wire-Wrap''; Manufacturer: KONTEK COMATEL; Part Number: COMATEL_385.0358.1.03.400; Component Kind: Standard; Component Type: Standard; Pin Count: 3; Family: Test Point; Mounted: Yes; Socket: No; SMD: No; Status: None; Manufacturer Part Number: 385.0358.1.03.400; ComponentHeight: 8mm; HelpURL: \\cern.ch\dfs\Applications\Altium\Datasheets\COMATEL_385.0358.1.03.400.pdf; Author: CERN DEM JLC; CreateDate: 2010-06-30; LatestRevisionDate: 2010-06-30; Table: COMATEL
W7-W12 = COMATEL_385.0358.1.02.400: 2 Mini Wire-Wrap Contact Strip Header; Part Description: 2 Contacts Straight Strip Header Pitch 2.54mm L=6.3mm ''Mini-Wire-Wrap''; Manufacturer: KONTEK COMATEL; Part Number: COMATEL_385.0358.1.02.400; Component Kind: Standard; Component Type: Standard; Pin Count: 2; Family: Test Point; Mounted: Yes; Socket: No; SMD: No; Status: None; Manufacturer Part Number: 385.0358.1.02.400; ComponentHeight: 8mm; HelpURL: \\cern.ch\dfs\Applications\Altium\Datasheets\COMATEL_385.0358.1.02.400.pdf; Author: CERN DEM JLC; CreateDate: 2010-06-30; LatestRevisionDate: 2010-06-30; Table: COMATEL